# EAGLE design Atmega1280_xmem_512K (EAGLE 7.4.0)
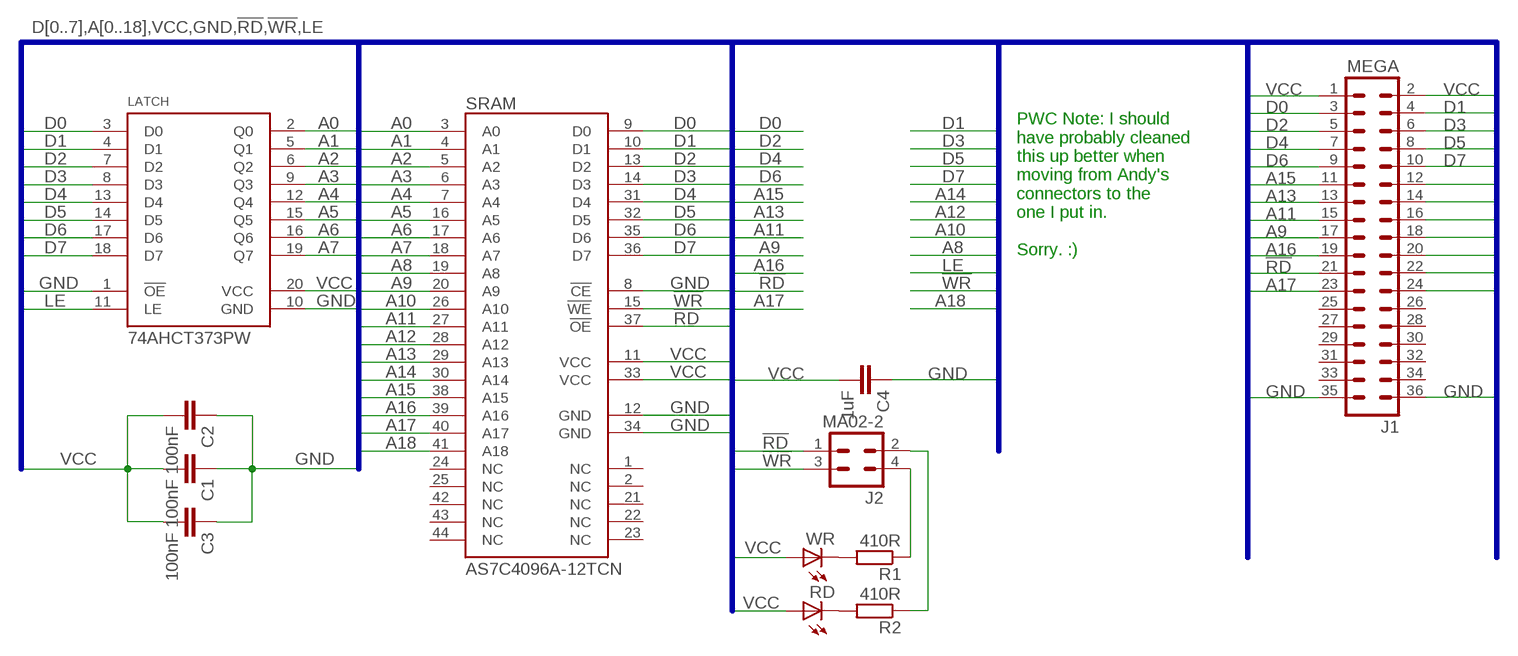
[diagram p0: schematic, sheet 1]

## Parts
C1  100nF  C-EUC0603  [C0603]
C2  100nF  C-EUC0603  [C0603]
C3  100nF  C-EUC0603  [C0603]
C4  1uF  C-EUC0603  [C0603]
J1  MEGA  MA18-2  [MA18-2]
J2  MA02-2  [MA02-2]
LATCH  74AHCT373PW  [TSSOP20]
R1  410R  R-EU_R0805  [R0805]
R2  410R  R-EU_R0805  [R0805]
RD  LEDSMT1206  [1206]
SRAM  AS7C4096A-12TCN  [TSOP44-II]
WR  LEDSMT1206  [1206]

## Nets
!RD: J1.21 J2.1 SRAM.37(!OE)
!WR: J1.22 J2.3 SRAM.15(!WE)
A0: LATCH.2(Q0) SRAM.3(A0)
A1: LATCH.5(Q1) SRAM.4(A1)
A2: LATCH.6(Q2) SRAM.5(A2)
A3: LATCH.9(Q3) SRAM.6(A3)
A4: LATCH.12(Q4) SRAM.7(A4)
A5: LATCH.15(Q5) SRAM.16(A5)
A6: LATCH.16(Q6) SRAM.17(A6)
A7: LATCH.19(Q7) SRAM.18(A7)
A8: J1.18 SRAM.19(A8)
A9: J1.17 SRAM.20(A9)
A10: J1.16 SRAM.26(A10)
A11: J1.15 SRAM.27(A11)
A12: J1.14 SRAM.28(A12)
A13: J1.13 SRAM.29(A13)
A14: J1.12 SRAM.30(A14)
A15: J1.11 SRAM.38(A15)
A16: J1.19 SRAM.39(A16)
A17: J1.23 SRAM.40(A17)
A18: J1.24 SRAM.41(A18)
D0: J1.3 LATCH.3(D0) SRAM.9(D0)
D1: J1.4 LATCH.4(D1) SRAM.10(D1)
D2: J1.5 LATCH.7(D2) SRAM.13(D2)
D3: J1.6 LATCH.8(D3) SRAM.14(D3)
D4: J1.7 LATCH.13(D4) SRAM.31(D4)
D5: J1.8 LATCH.14(D5) SRAM.32(D5)
D6: J1.9 LATCH.17(D6) SRAM.35(D6)
D7: J1.10 LATCH.18(D7) SRAM.36(D7)
GND [power]: C1.1 C2.1 C3.1 C4.1 J1.35 J1.36 LATCH.1(!OE) LATCH.10(GND) SRAM.8(!CE) SRAM.12(GND) SRAM.34(GND)
LE: J1.20 LATCH.11(LE)
N$1: J2.4 R1.1
N$2: J2.2 R2.1
N$3: R2.2 RD.C
N$4: R1.2 WR.C
VCC [power]: C1.2 C2.2 C3.2 C4.2 J1.1 J1.2 LATCH.20(VCC) RD.A SRAM.11(VCC) SRAM.33(VCC) WR.A
Unconnected: J1.25 J1.26 J1.27 J1.28 J1.29 J1.30 J1.31 J1.32 J1.33 J1.34 SRAM.1(NC) SRAM.2(NC) SRAM.21(NC) SRAM.22(NC) SRAM.23(NC) SRAM.24(NC) SRAM.25(NC) SRAM.42(NC) SRAM.43(NC) SRAM.44(NC)

## Buses
D[0..7],A[0..18],VCC,GND,!RD,!WR,LE

## Notes on the sheet
- PWC Note: I should
  have probably cleaned
  this up better when
  moving from Andy's
  connectors to the
  one I put in.
  
  Sorry. :)

## Library data of the parts
C1-C4 = resistor:C-EU: CAPACITOR, European symbol
J1 = con-lstb:MA18-2: PIN HEADER
J2 = con-lstb:MA02-2: PIN HEADER
LATCH = andy:74AHCT373PW
R1 R2 = resistor:R-EU_: RESISTOR, European symbol
RD WR = led:LED: LED OSRAM: - CHIPLED LG R971, LG N971, LY N971, LG Q971, LY Q971, LO R971, LY R971 LH N974, LH R974 LS Q976, LO Q976, LY Q976 LO Q996 - Hyper CHIPLED LW Q18S LB Q993, LB Q99A, LB R99A - SideLED LS A670, LO A670, LY A670, LG A670, LP A670 LB A673, LV A673, LT A673, LW A673 LH A674 LY A675 LS A676, LA A676, LO A676, LY A676, LW A676 LS A679, LY A679, LG A679 - Hyper Micro SIDELED® LS Y876, LA Y876, LO Y876, LY Y876 LT Y87S - SmartLED LW L88C, LW L88S LB L89C, LB L89S, LG L890 LS L89K, LO L89K, LY L89K LS L896, LA L896, LO L896, LY L896 - TOPLED LS T670, LO T670, LY T670, LG T670, LP T670 LSG T670, LSP T670, LSY T670, LOP T670, LYG T670 LG T671, LOG T671, LSG T671 LB T673, LV T673, LT T673, LW T673 LH T674 LS T676, LA T676, LO T676, LY T676, LB T676, LH T676, LSB T676, LW T676 LB T67C, LV T67C, LT T67C, LS T67K, LO T67K, LY T67K, LW E67C LS E67B, LA E67B, LO E67B, LY E67B, LB E67C, LV E67C, LT E67C LW T67C LS T679, LY T679, LG T679 LS T770, LO T770, LY T770, LG T770, LP T770 LB T773, LV T773, LT T773, LW T773 LH T774 LS E675, LA E675, LY E675, LS T675 LS T776, LA T776, LO T776, LY T776, LB T776 LHGB T686 LT T68C, LB T68C - Hyper Mini TOPLED® LB M676 - Mini TOPLED Santana® LG M470 LS M47K, LO M47K, LY M47K Source: http://www.osram.convergy.de LUXEON: - LUMILED® LXK2-PW12-R00, LXK2-PW12-S00, LXK2-PW14-U00, LXK2-PW14-V00 LXK2-PM12-R00, LXK2-PM12-S00, LXK2-PM14-U00 LXK2-PE12-Q00, LXK2-PE12-R00, LXK2-PE12-S00, LXK2-PE14-T00, LXK2-PE14-U00 LXK2-PB12-K00, LXK2-PB12-L00, LXK2-PB12-M00, LXK2-PB14-N00, LXK2-PB14-P00, LXK2-PB14-Q00 LXK2-PR12-L00, LXK2-PR12-M00, LXK2-PR14-Q00, LXK2-PR14-R00 LXK2-PD12-Q00, LXK2-PD12-R00, LXK2-PD12-S00 LXK2-PH12-R00, LXK2-PH12-S00 LXK2-PL12-P00, LXK2-PL12-Q00, LXK2-PL12-R00 Source: www.luxeon.com KINGBRIGHT: KA-3528ASYC Source: www.kingbright.com
SRAM = andy:AS7C4096A-12TCN

## Net classes
0 default: width 0.152 mm
1 power: width 0.203 mm

## Board
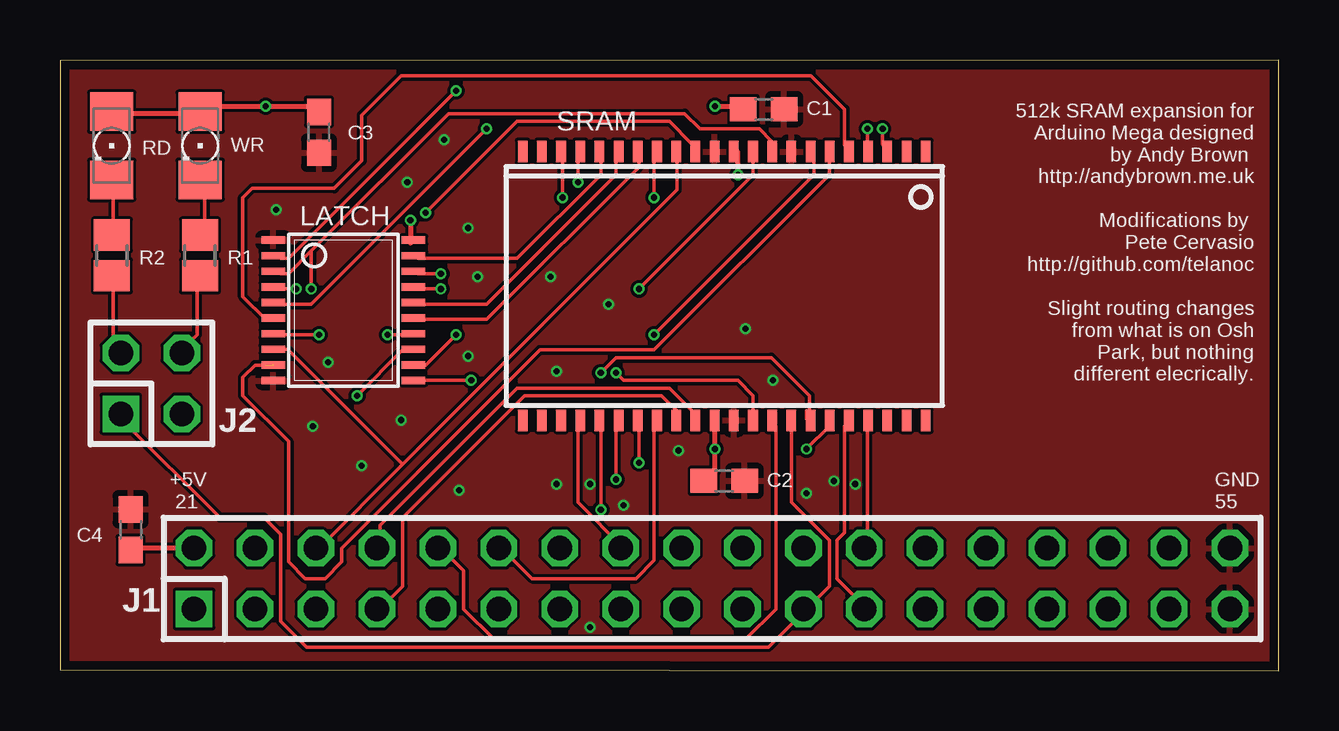
[diagram p1: board, top side]
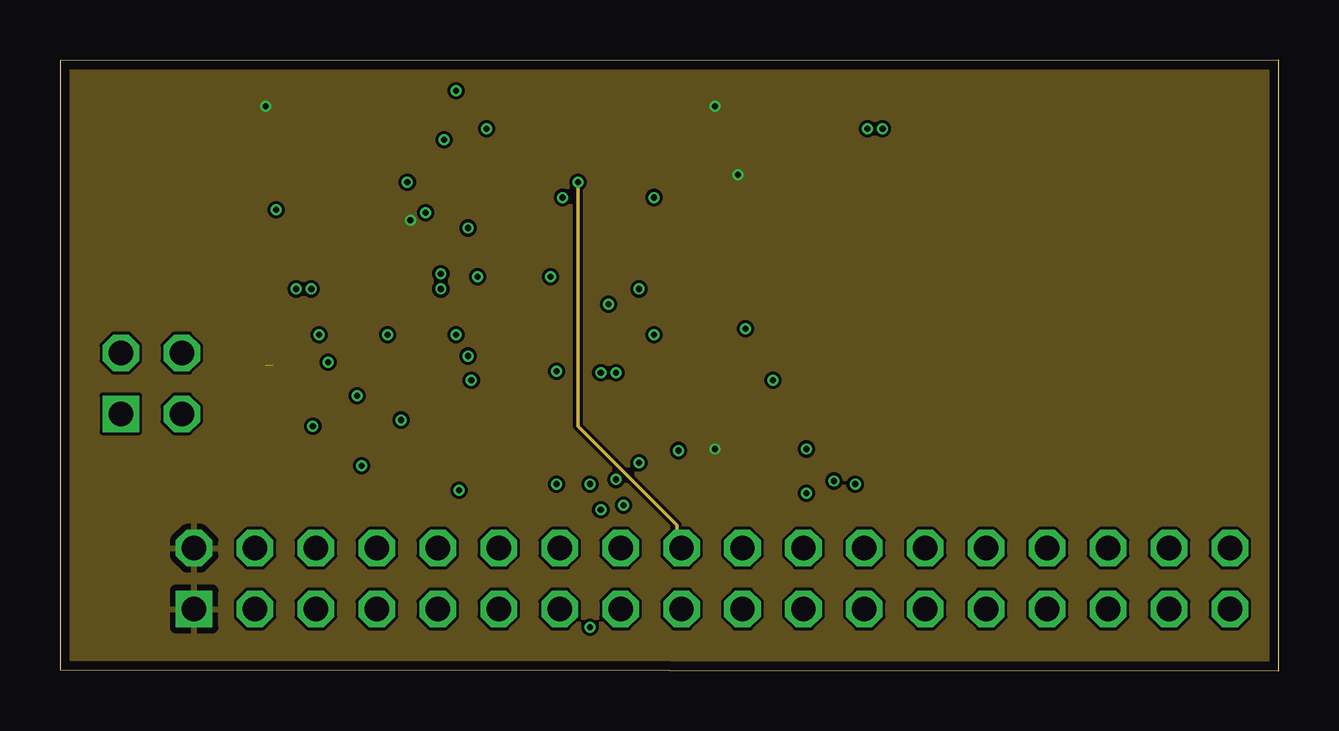
[diagram p2: board, inner layer Route2]
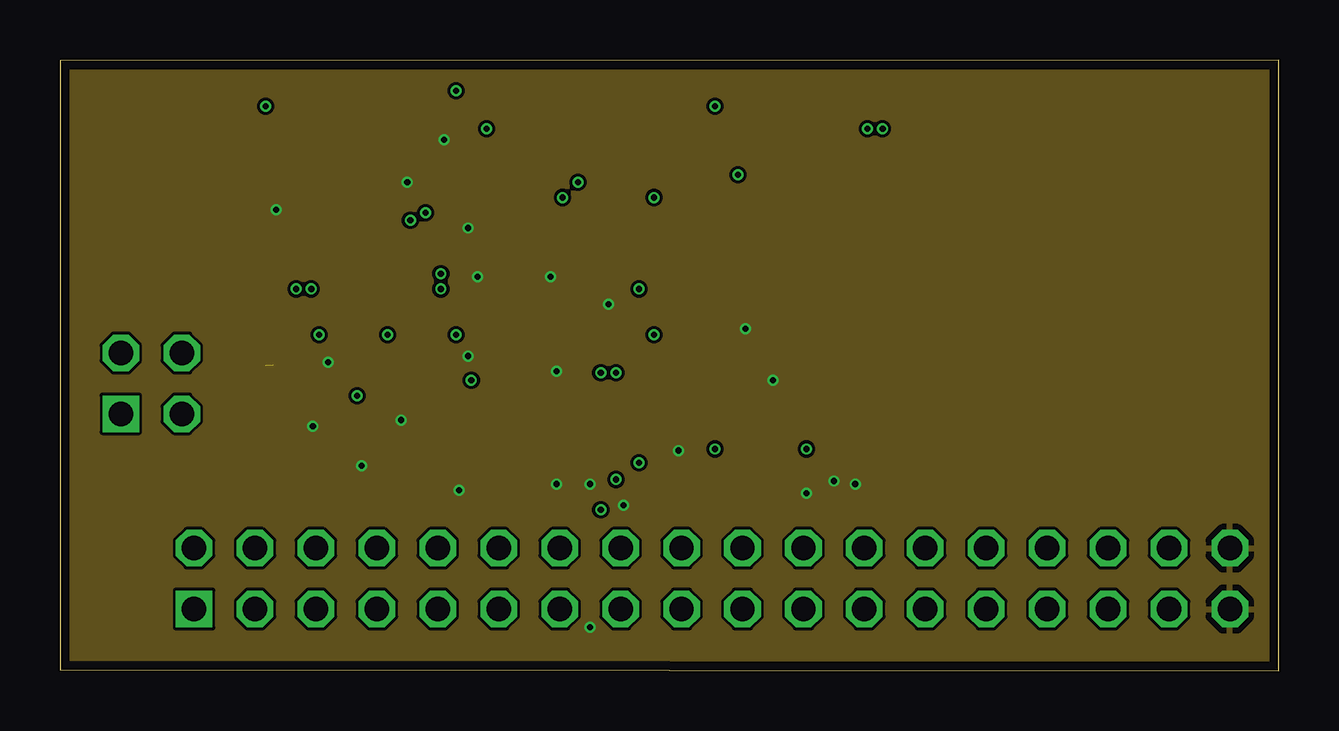
[diagram p3: board, inner layer Route15]
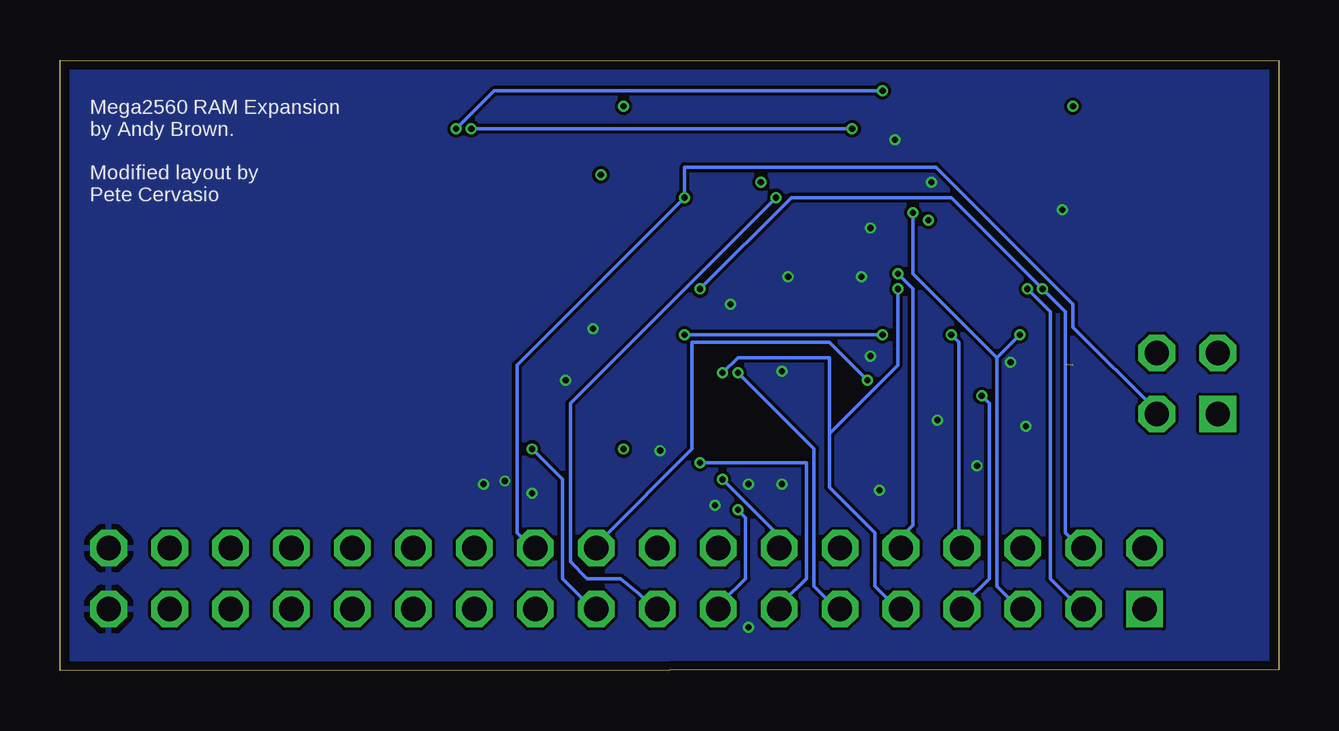
[diagram p4: board, bottom side, seen from below]

Size 50.8 x 25.44 mm. Coordinates in mm from the lower left corner, seen from the top.
Outline: 0,0.03 50.8,0 50.8,25.44 0,25.42 0,0.03
Copper layers (1*2*15*16): Top 0.035559375mm / dielectric 0.17018125mm / Route2 0.01778125mm / dielectric 47mil / Route15 0.01778125mm / dielectric 0.17018125mm / Bottom 0.035559375mm
Design rules "OSHPark-4layer": minimum track width 5mil, minimum drill 10mil, track to track 5mil, track to pad 5mil, pad to pad 5mil, via to via 5mil, smd to smd 5mil, copper to edge 15mil, drill to drill 6mil, minimum pad ring 4mil, minimum via ring 4mil, stop-mask expansion 4mil, vias tented up to drill 0mil, thermal gap 10mil

### Footprints (pad centres in the part's own frame; a part is rotated, then mirrored left to right if it is on the bottom)
C0603 = smd 1.1 x 1: 1 -0.85,0; 2 0.85,0
MA18-2 = drill 1.016 square: 1 -21.59,-1.27 | drill 1.016 octagon: 2 -21.59,1.27; 3 -19.05,-1.27; 4 -19.05,1.27; 5 -16.51,-1.27; 6 -16.51,1.27; 7 -13.97,-1.27; 8 -13.97,1.27; 9 -11.43,-1.27; 10 -11.43,1.27; 11 -8.89,-1.27; 12 -8.89,1.27; 13 -6.35,-1.27; 14 -6.35,1.27; 15 -3.81,-1.27; 16 -3.81,1.27; 17 -1.27,-1.27; 18 -1.27,1.27; 19 1.27,-1.27; 20 1.27,1.27; 21 3.81,-1.27; 22 3.81,1.27; 23 6.35,-1.27; 24 6.35,1.27; 25 8.89,-1.27; 26 8.89,1.27; 27 11.43,-1.27; 28 11.43,1.27; 29 13.97,-1.27; 30 13.97,1.27; 31 16.51,-1.27; 32 16.51,1.27; 33 19.05,-1.27; 34 19.05,1.27; 35 21.59,-1.27; 36 21.59,1.27
MA02-2 = drill 1.016 square: 1 -1.27,-1.27 | drill 1.016 octagon: 2 -1.27,1.27; 3 1.27,-1.27; 4 1.27,1.27
TSSOP20 = smd 0.305 x 0.991: 1 -2.925,-2.918; 2 -2.275,-2.918; 3 -1.625,-2.918; 4 -0.975,-2.918; 5 -0.325,-2.918; 6 0.325,-2.918; 7 0.975,-2.918; 8 1.625,-2.918; 9 2.275,-2.918; 10 2.925,-2.918; 11 2.925,2.918; 12 2.275,2.918; 13 1.625,2.918; 14 0.975,2.918; 15 0.325,2.918; 16 -0.325,2.918; 17 -0.975,2.918; 18 -1.625,2.918; 19 -2.275,2.918; 20 -2.925,2.918
R0805 = smd 1.3 x 1.5: 1 -0.85,0; 2 0.85,0
1206 = smd 1.6 x 1.803: A -1.422,0; C 1.422,0
TSOP44-II = smd 0.4 x 0.9: 1 -8.4,-5.6; 2 -7.6,-5.6; 3 -6.8,-5.6; 4 -6,-5.6; 5 -5.2,-5.6; 6 -4.4,-5.6; 7 -3.6,-5.6; 8 -2.8,-5.6; 9 -2,-5.6; 10 -1.2,-5.6; 11 -0.4,-5.6; 12 0.4,-5.6; 13 1.2,-5.6; 14 2,-5.6; 15 2.8,-5.6; 16 3.6,-5.6; 17 4.4,-5.6; 18 5.2,-5.6; 19 6,-5.6; 20 6.8,-5.6; 21 7.6,-5.6; 22 8.4,-5.6; 23 8.4,5.6; 24 7.6,5.6; 25 6.8,5.6; 26 6,5.6; 27 5.2,5.6; 28 4.4,5.6; 29 3.6,5.6; 30 2.8,5.6; 31 2,5.6; 32 1.2,5.6; 33 0.4,5.6; 34 -0.4,5.6; 35 -1.2,5.6; 36 -2,5.6; 37 -2.8,5.6; 38 -3.6,5.6; 39 -4.4,5.6; 40 -5.2,5.6; 41 -6,5.6; 42 -6.8,5.6; 43 -7.6,5.6; 44 -8.4,5.6

### Placement (x,y rotation side)
C1  29.34,23.39 180 top
C2  27.69,7.9 180 top
C3  10.79,22.43 90 top
C4  2.95,5.87 270 top
J1  27.18,3.84 0 top
J2  3.81,11.96 0 top
LATCH  11.81,15.01 270 top
R1  5.84,17.3 90 top
R2  2.16,17.3 90 top
RD  2.16,21.87 270 top
SRAM  27.69,16.03 180 top
WR  5.84,21.87 270 top

### Tracks (layer width: path | path; a pad name or v marks a point on that pad's centre or on a via)
!RD
  Top 0.152: 31.11,2.57 32.07,3.52 32.07,5.42 30.48,7.01 30.48,10.19 SRAM.37 | 31.11,2.57 29.53,0.98 10.29,0.98 9.21,2.06 9.21,5.68 8.51,6.38 6.67,6.38 2.54,10.5 J2.1 | 31.11,2.57 J1.21
!WR  (via drill 0.25)
  Top 0.152: v24.77,19.71 24.77,21.62 SRAM.15
  Bottom 0.152: J1.22 31.11,5.11 31.75,5.74 31.75,12.73 v24.77,19.71 24.77,20.98 14.29,20.98 8.57,15.27 8.57,14.31 5.08,10.82 J2.3
A0  (via drill 0.25)
  Top 0.152: v34.29,22.57 34.29,21.93 SRAM.3 | v16.51,24.16 9.53,17.17 9.21,17.17 LATCH.2
  Bottom 0.152: v34.29,22.57 32.7,24.16 v16.51,24.16
A1  (via drill 0.25)
  Top 0.152: v33.66,22.57 33.66,21.93 SRAM.4 | v17.78,22.57 10.48,15.27 9.21,15.27 LATCH.5
  Bottom 0.152: v17.78,22.57 v33.66,22.57
A2
  Top 0.152: SRAM.5 32.7,21.93 32.7,23.39 31.3,24.79 14.22,24.79 12.57,23.14 12.57,21.23 11.43,20.09 8,20.09 7.62,19.71 7.62,15.58 8.57,14.63 8.89,14.63 LATCH.6
A3  (1 unrouted)
  Top 0.152: SRAM.6 32.07,21.62 32.07,20.66 24.77,13.36 20,13.36 11.75,5.11 11.75,4.53 11.05,3.84 10.22,3.84 9.53,4.53 9.53,9.55 7.62,11.46 7.62,12.22 8.13,12.73 8.57,12.73 | LATCH.9
A4  (via drill 0.25)
  Top 0.152: v24.77,14 31.43,20.66 31.43,21.62 SRAM.7 | v16.51,14 15.24,12.73 14.92,12.73 LATCH.12
  Bottom 0.152: v16.51,14 v24.77,14
A5
  Top 0.152: SRAM.16 24.13,21.62 24.13,20.98 17.78,14.63 14.92,14.63 LATCH.15
A6
  Top 0.152: SRAM.17 23.18,21.62 23.18,20.66 17.78,15.27 14.92,15.27 LATCH.16
A7
  Top 0.152: SRAM.18 22.54,21.62 22.54,20.66 19.05,17.17 14.92,17.17 LATCH.19
A8  (via drill 0.25)
  Top 0.152: v21.59,20.35 21.59,21.62 SRAM.19
  Route2 0.152: v21.59,20.35 21.59,10.19 25.72,6.06 25.72,5.11 J1.18
A9  (via drill 0.25)
  Top 0.152: v20.95,19.71 20.95,21.62 SRAM.20
  Bottom 0.152: v20.95,19.71 29.53,11.14 29.53,4.53 28.83,3.84 27.43,3.84 26.67,3.2 26.04,2.57 J1.17
A10
  Top 0.152: SRAM.26 21.59,10.19 21.59,7.01 23.5,5.11 J1.16
A11  (via drill 0.25)
  Top 0.152: v22.54,6.69 22.54,10.19 SRAM.27
  Bottom 0.152: v22.54,6.69 22.23,6.38 22.23,3.84 23.18,2.88 23.18,2.57 J1.15
A12  (via drill 0.25)
  Top 0.152: v23.18,7.96 23.18,10.19 SRAM.28
  Bottom 0.152: v23.18,7.96 20.95,5.74 20.95,5.11 J1.14
A13  (via drill 0.25)
  Top 0.152: v24.13,8.66 24.13,10.19 SRAM.29
  Bottom 0.152: v24.13,8.66 19.68,8.66 19.68,3.84 20.64,2.88 20.64,2.57 J1.13
A14
  Top 0.152: SRAM.30 24.77,10.19 24.77,4.6 24,3.84 19.68,3.84 18.41,5.11 J1.12
A15  (via drill 0.25)
  Top 0.152: 31.11,10.82 31.11,10.5 SRAM.38 31.24,10.47 31.24,11.46 29.65,13.04 23.18,13.04 v22.54,12.41
  Bottom 0.152: v22.54,12.41 19.37,9.23 19.37,3.52 18.41,2.57 J1.11
A16  (via drill 0.25)
  Top 0.152: v31.11,9.23 32.07,10.19 SRAM.39
  Bottom 0.152: v31.11,9.23 29.84,7.96 29.84,3.84 28.57,2.57 J1.19
A17
  Top 0.152: SRAM.40 32.7,10.19 32.7,5.74 32.38,5.42 32.38,3.84 33.66,2.57 J1.23
A18
  Top 0.152: SRAM.41 33.66,10.19 33.66,5.11 J1.24
D0  (via drill 0.25)
  Top 0.152: 10.48,17.49 9.53,16.54 9.21,16.54 LATCH.3 | 10.48,17.49 16.19,23.2 26.04,23.2 26.67,22.57 29.15,22.57 29.65,22.06 29.65,21.66 SRAM.9 | 10.48,17.49 v10.48,15.9
  Bottom 0.152: v10.48,15.9 9.53,14.95 9.53,3.84 8.26,2.57 J1.3
D1  (via drill 0.25)
  Top 0.152: v24.13,15.9 28.89,20.66 SRAM.10 | v9.84,15.9 9.21,15.9 LATCH.4
  Bottom 0.152: v24.13,15.9 20.32,19.71 13.65,19.71 v9.84,15.9 8.89,14.95 8.89,5.74 8.26,5.11 J1.4
D2  (via drill 0.25)
  Top 0.152: v15.24,19.08 19.05,22.89 25.4,22.89 26.35,21.93 SRAM.13 | v10.79,14 9.21,14 LATCH.7
  Bottom 0.152: v15.24,19.08 15.24,16.54 11.75,13.04 | 11.75,13.04 11.75,3.52 10.79,2.57 J1.5 | 11.75,13.04 v10.79,14
D3
  Top 0.152: 14.29,8.6 10.79,5.11 J1.6 | 14.29,8.6 25.72,20.03 25.72,21.62 SRAM.14 | LATCH.8 9.5,13.39 14.29,8.6
D4  (via drill 0.25)
  Top 0.152: SRAM.31 25.72,10.5 25.72,10.82 25.08,11.46 19.37,11.46 14.29,6.38 14.29,3.52 13.34,2.57 J1.7 | v12.38,11.46 14.29,13.36 14.61,13.36 LATCH.13
  Bottom 0.152: v12.38,11.46 12.06,11.14 12.06,3.84 13.02,2.88 13.02,2.57 J1.7
D5  (via drill 0.25)
  Top 0.152: SRAM.32 26.35,10.5 26.35,10.82 25.4,11.77 19.05,11.77 13.34,6.06 13.34,5.11 J1.8 | v13.65,14 14.61,14 LATCH.14
  Bottom 0.152: v13.65,14 13.34,13.68 13.34,5.11 J1.8
D6  (via drill 0.25)
  Top 0.152: SRAM.35 28.89,10.5 28.89,11.46 28.26,12.09 23.5,12.09 v23.18,12.41 | v15.88,15.9 14.92,15.9 LATCH.17
  Bottom 0.152: v23.18,12.41 22.54,13.04 18.73,13.04 18.73,9.87 | 18.73,9.87 18.73,7.65 16.83,5.74 16.83,3.52 15.88,2.57 J1.9 | v15.88,15.9 15.88,12.73 18.73,9.87
D7  (via drill 0.25)
  Top 0.152: SRAM.36 29.84,10.19 29.84,2.57 28.57,1.3 18.1,1.3 16.83,2.57 16.83,4.15 15.88,5.11 J1.10 | v15.88,16.54 14.92,16.54 LATCH.18
  Bottom 0.152: v15.88,16.54 15.24,15.9 15.24,6.06 15.56,5.74 15.56,5.11 J1.10
GND  (via drill 0.25)
  other vias: 22.86,15.27 20.45,16.41 20.7,7.77 14.22,10.44 17.02,18.44 17.4,16.41 16,22.12 32.26,7.9 31.11,7.39 25.78,9.17 23.5,6.88 22.1,7.77 22.1,1.8 11.18,12.85 10.54,10.19 28.57,14.25 14.48,20.35 9.02,19.2 33.15,7.77 16.64,7.52 20.7,12.47 29.72,12.09 12.57,8.53 17.02,13.11
  pour Bottom: 0,25.43 50.93,25.55 50.93,-0.1 0,0.03
  pour Route15: 0,25.43 50.93,25.43 50.93,-0.1 0,0.03
  pour Top: 0,25.43 50.93,25.43 50.93,-0.1 0,0.03
LE  (via drill 0.25)
  Top 0.152: v17.14,12.09 14.92,12.09 LATCH.11
  Bottom 0.152: v17.14,12.09 18.73,13.68 24.45,13.68 24.45,9.23 28.26,5.42 28.26,5.11 J1.20
N$1
  Top 0.152: R1.1 5.71,16.22 5.71,14 5.08,13.36 J2.4
N$2
  Top 0.152: R2.1 2.22,16.22 2.22,13.68 2.54,13.36 J2.2
N$3
  Top 0.152: R2.2 2.22,18.44 2.22,20.35 RD.C
N$4
  Top 0.152: R1.2 6.03,18.44 6.03,20.35 WR.C
VCC  (via drill 0.25)
  Top 0.203: C3.2 10.79,23.52 v8.57,23.52 6.03,23.52 WR.A 5.71,23.2 2.22,23.2 RD.A | SRAM.33 27.3,10.19 v27.3,9.23 27.3,8.28 26.99,7.96 C2.2 | v28.26,20.66 28.26,21.62 SRAM.11 | v14.61,18.76 14.61,17.81 LATCH.20 | J1.2 3.17,5.11 C4.2 | v27.3,23.52 28.26,23.52 C1.2
  pour Route2: 0,25.43 50.93,25.43 50.93,-0.1 0,0.03

### Text on the board
tNames: 512k SRAM expansion for / Arduino Mega designed / by Andy Brown / http://andybrown.me.uk / / Modifications by / Pete Cervasio / http://github.com/telanoc / / Slight routing changes / from what is on Osh / Park, but nothing / different elecrically. | +5V / 21 | GND / 55
bNames: Mega2560 RAM Expansion / by Andy Brown. / / Modified layout by / Pete Cervasio